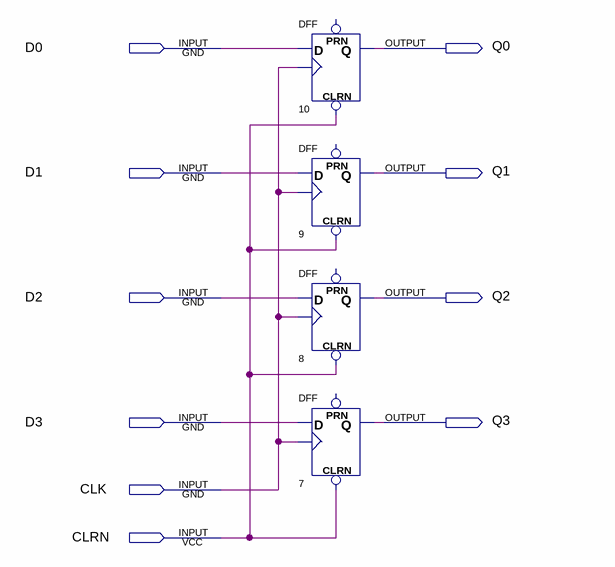
[diagram p0: schematic sheet]
// Quartus schematic Registrador_4_bits.bdf as structural Verilog: 4 symbols, 10 pins
module Registrador_4_bits (
  input  D0,
  input  D1,
  input  D2,
  input  D3,
  input  CLK,
  input  CLRN,
  output Q0,
  output Q1,
  output Q2,
  output Q3
);

  DFF u_10 (.CLRN(CLRN), .CLK(CLK), .D(D0), .Q(Q0));  // open: PRN
  DFF u_9 (.CLRN(CLRN), .CLK(CLK), .D(D1), .Q(Q1));  // open: PRN
  DFF u_8 (.CLRN(CLRN), .CLK(CLK), .D(D2), .Q(Q2));  // open: PRN
  DFF u_7 (.CLRN(CLRN), .CLK(CLK), .D(D3), .Q(Q3));  // open: PRN
endmodule
